# Altium schematic sheet CANOPi_Baseboard_RTC.SchDoc
size A4; DocumentNumber: 5; SheetNumber: 5; SheetTotal: 5; CopyrightYear: 2021
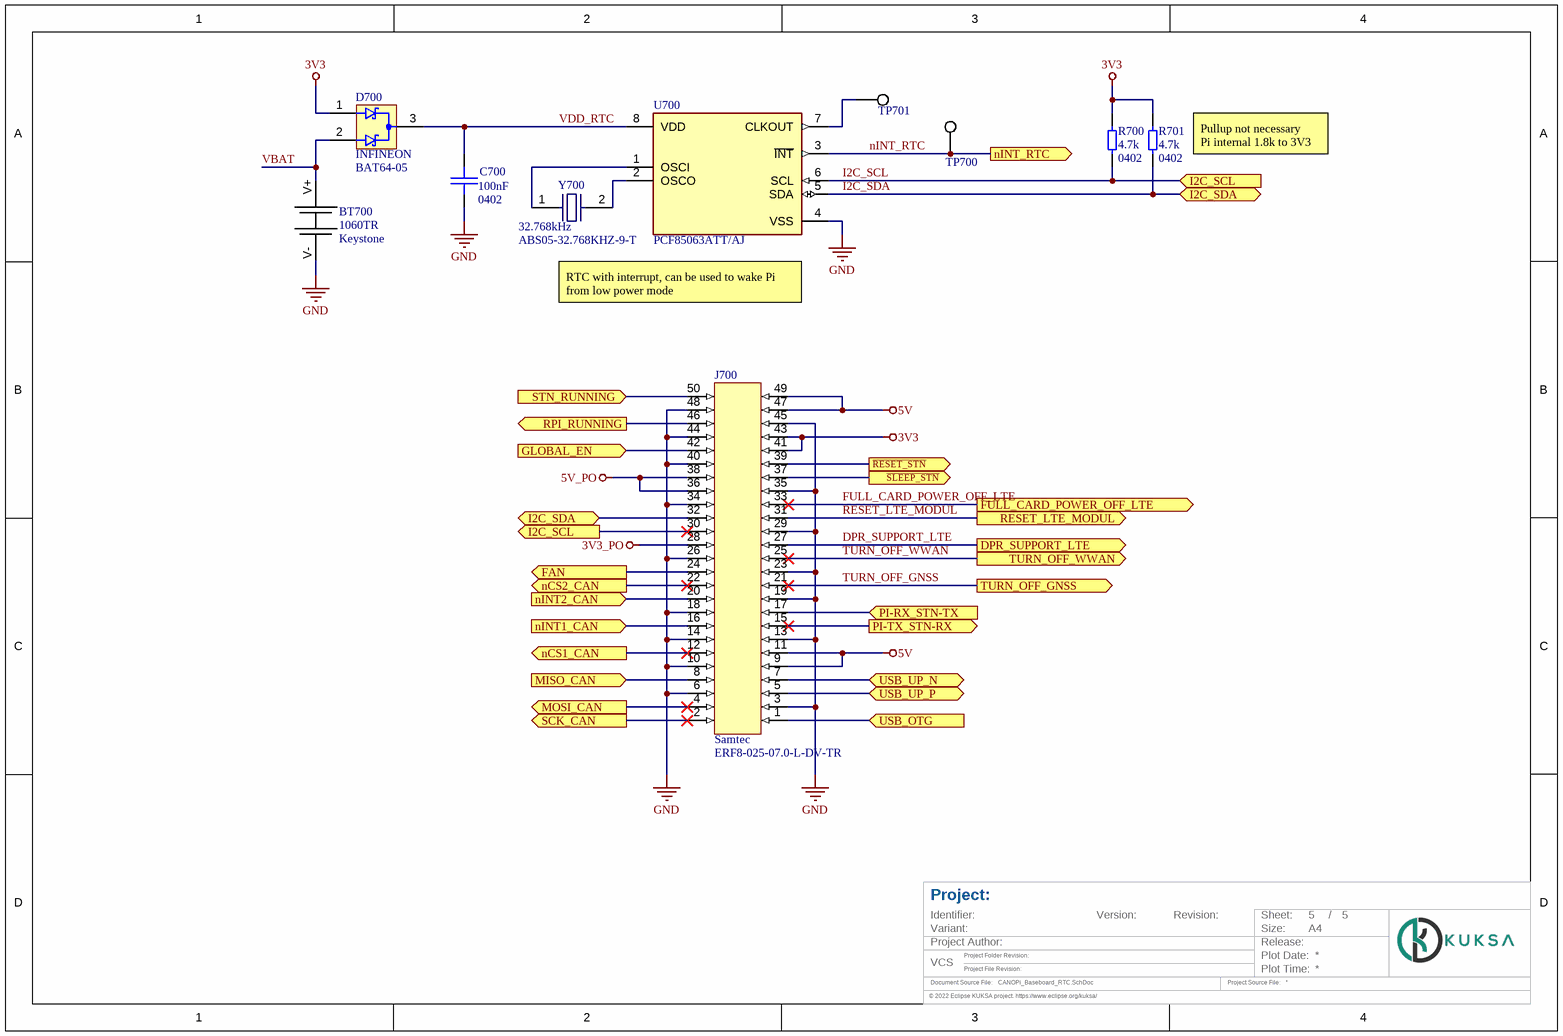
[diagram p0: CANOPi_Baseboard_RTC.SchDoc]

## Parts
BT700  Manufacturer Part Number: 1060TR  Manufacturer: Keystone  [KEYSTONE - 1060-Footprint-1]  (hidden comment: KEYSTONE - 1060)
C700  Capacitance: 100nF  Case: 0402  [CAP 0402 [1005 Metric] X050 N]  (hidden comment: CAP 0402 100n -10% +10% 6.3V X7R)
D700  Manufacturer: INFINEON  Manufacturer Part Number: BAT64-05  [INFINEON - BAT64-04]  (hidden comment: INFINEON - BAT64-05)
J700  Manufacturer: Samtec  Manufacturer Part Number: ERF8-025-07.0-L-DV-TR  [SAMTEC - ERF-025-05.0-L-DV-TR-Footprint-1]  (hidden comment: SAMTEC - ERF8-025-07.0-L-DV-TR)
R700  Resistance: 4.7k  Case: 0402  [RES 0402 [1005 Metric]_N]  (hidden comment: RES 0402 4K7 1% 0W0625)
R701  Resistance: 4.7k  Case: 0402  [RES 0402 [1005 Metric]_N]  (hidden comment: RES 0402 4K7 1% 0W0625)
TP700  Testpad, 0.8mm x 0.8mm, round  [Testpad, 0.8mm x 0.8mm, round]  (value not drawn)  (no BOM)
TP701  Testpad, 0.8mm x 0.8mm, round  [Testpad, 0.8mm x 0.8mm, round]  (value not drawn)  (no BOM)
U700  PCF85063ATT/AJ  [FP-SOT505-1-MFG]
Y700  Manufacturer Part Number: ABS05-32.768KHZ-9-T  Frequency: 32.768kHz  [ABRACON - ABS05-32.768KHZ-9-T]  (hidden comment: ABRACON - ABS05-32.768KHZ-9-T)

## Ports
DPR_SUPPORT_LTE (out), FAN (out), FULL_CARD_POWER_OFF_LTE (out), GLOBAL_EN (in), I2C_SCL (in), I2C_SCL (out), I2C_SDA (bidir), MISO_CAN (in), MOSI_CAN (out), nCS1_CAN (out), nCS2_CAN (out), nINT1_CAN (in), nINT2_CAN (in), nINT_RTC (out), PI-RX_STN-TX (in), PI-TX_STN-RX (out), RESET_LTE_MODUL (out), RPI_RUNNING (out), SCK_CAN (out), STN_RUNNING (in), TURN_OFF_GNSS (out), TURN_OFF_WWAN (out), USB_OTG (in), USB_UP_N (bidir), USB_UP_P (bidir), ~{RESET_STN} (out), ~{SLEEP_STN} (out)

## Nets
3V3: D700.1 J700.41 J700.43 R700.2 R701.2
3V3_PO: J700.28
5V: J700.9 J700.11 J700.47 J700.49
5V_PO: J700.36 J700.38
GND: BT700.V- C700.1 J700.3 J700.6 J700.10 J700.13 J700.14 J700.18 J700.19 J700.23 J700.26 J700.29 J700.34 J700.35 J700.40 J700.44 J700.45 J700.48 U700.4(VSS)
~{RESET_STN}: J700.39 ; port ~{RESET_STN}
~{SLEEP_STN}: J700.37 ; port ~{SLEEP_STN}
DPR_SUPPORT_LTE: J700.27 ; port DPR_SUPPORT_LTE
FAN: J700.24 ; port FAN
FULL_CARD_POWER_OFF_LTE: J700.33 ; port FULL_CARD_POWER_OFF_LTE
GLOBAL_EN: J700.42 ; port GLOBAL_EN
I2C_SCL: J700.30 R700.1 U700.6(SCL) ; port I2C_SCL
I2C_SDA: J700.32 R701.1 U700.5(SDA) ; port I2C_SDA
MISO_CAN: J700.8 ; port MISO_CAN
MOSI_CAN: J700.4 ; port MOSI_CAN
nCS1_CAN: J700.12 ; port nCS1_CAN
nCS2_CAN: J700.22 ; port nCS2_CAN
nINT1_CAN: J700.16 ; port nINT1_CAN
nINT2_CAN: J700.20 ; port nINT2_CAN
nINT_RTC: TP700.1 U700.3(~{INT}) ; port nINT_RTC
PI-RX_STN-TX: J700.17 ; port PI-RX_STN-TX
PI-TX_STN-RX: J700.15 ; port PI-TX_STN-RX
RESET_LTE_MODUL: J700.31 ; port RESET_LTE_MODUL
RPI_RUNNING: J700.46 ; port RPI_RUNNING
SCK_CAN: J700.2 ; port SCK_CAN
STN_RUNNING: J700.50 ; port STN_RUNNING
TURN_OFF_GNSS: J700.21 ; port TURN_OFF_GNSS
TURN_OFF_WWAN: J700.25 ; port TURN_OFF_WWAN
USB_OTG: J700.1 ; port USB_OTG
USB_UP_N: J700.7 ; port USB_UP_N
USB_UP_P: J700.5 ; port USB_UP_P
VBAT: BT700.V+ D700.2
VDD_RTC: C700.2 D700.3 U700.8(VDD)
NetTP701_1: TP701.1 U700.7(CLKOUT)
NetU700_1: U700.1(OSCI) Y700.1
NetU700_2: U700.2(OSCO) Y700.2

## Notes on the sheet
- (near R701) Pullup not necessary
  Pi internal 1.8k to 3V3
- RTC with interrupt, can be used to wake Pi from low power mode
- Project:
- Identifier:
- Version:
- Revision:
- Sheet:
- /
- VCS
- Variant:
- Document Source File:
- Project Author:
- Project Folder Revision:
- Project File Revision:
- Project Source File:
- Plot Date:
- Size:
- Plot Time:
- Release:
- A4
- © 2022 Eclipse KUKSA project. https://www.eclipse.org/kuksa/
- Drawn by:
- © Robert Bosch GmbH         . All rights reserved, also regarding any disposal, exploitation, reproduction, editing, distribution, as well as in the event of applications for industrial property rights.

## Library data of the parts
BT700 = CMP-11274-2: Batterie Halter (offen) Kreisförmige Scheibe, 20,0mm 1 Zellen SMD (SMT) Tab; Assembly: yes; Battery Sizes Accepted: CR2032; No. of Batteries: 1; Operating Temperature min: -50°C; ComponentLink1URL: https://www.keyelco.com/product.cfm/product_id/726; Case: Coin; ComponentLink1Description: Manufacturer Link; Operating Temperature max: 146°C; Mounting Type: SMT
C700 = CMP-04212-4: SMD/SMT 0402 6.3V -10% +10% X7R - Multilayer Ceramic Capacitors MLCC; Manufacturer: MURATA; Manufacturer Part Number: GRM155R70J104KA01#; Capacitance Tolerance pos: 10%; Value: 100nF; Assembly: yes; Operating Temperature min: -55°C; Voltage Rating: 6.3V; Operating Temperature max: 125°C; ComponentLink1URL: http://psearch.en.murata.com/capacitor/lineup/grm/; IPC Footprint Naming: CAPC1005X050; Capacitance Tolerance neg: -10%; ComponentLink1Description: Datasheet; Dielectric Type: X7R; Mounting Type: SMT
D700 = CMP-07595-3: Dual Silicon Schottky Diodes; Assembly: yes; Forward Current: 250mA; Forward Voltage: 750mV; Reverse Voltage: 40V; Case: SOT-23; ComponentLink1Description: Datasheet; ComponentLink1URL: https://www.infineon.com/dgdl/Infineon-BAT64SERIES-DataSheet-v01_00-EN.pdf?fileId=5546d4626d66c2b1016d73f85ab420ed; Mounting Type: SMT; Operating Temperature max: 150°C; Operating Temperature min: -55°C
J700 = CMP-11271-4: 50 Poliger Steckverbinder Sockel, äußere Abdeckungskontakte Oberflächenmontage Gold; Current Rating: 1,1A; Voltage Rating: 200V; Gender: Female; Pitch Spacing: 800µm; Assembly: yes; System: Connector; ComponentLink1URL: https://www.samtec.com/de/products/erf8-025-07.0-l-dv-k-tr; ComponentLink1Description: Manufacturer Link; Operating Temperature max: 150°C; Operating Temperature min: -40°C; Number of Rows: 2; Mounting Type: SMT; Number of Pins: 50
R700 R701 = CMP-00920-7: RC0402 series chip resistor with lead-free terminations made by thick film process; Manufacturer Part Number: RC0402FR-074K7L; Manufacturer: YAGEO; Value: 4.7k; Power Rating: 62.5mW; Assembly: yes; Voltage Rating: 50V; Current Rating: 1A; Temperature Coefficient: ±100ppm/K; ComponentLink1URL: https://www.yageo.com/upload/media/product/productsearch/datasheet/rchip/PYu-RC_Group_51_RoHS_L_10.pdf; Operating Temperature max: 155°C; IPC Footprint Naming: RESC1005X04; Resistor Element Type: Thick Film; Mounting Type: SMT; Operating Temperature min: -55°C; ComponentLink1Description: Datasheet; Resistance Tolerance: 1%
TP700 TP701 = CMP-00390-13: Assembly: no; Case: 0.8x0.8mm, round
U700 = CMP-10083-000008-1: IC RTC CLK/CALENDAR I2C 8TSSOP; Manufacturer: NXP Semiconductors; Min Supply Voltage: 0.9V; Max Supply Voltage: 5.5V; Nominal Supply Current: 0.22-18uA; Number Of Outputs: 1; Standoff Height: 0.05mm; Frequency: 32.768kHz; Temperature Range Low: -40°C; Height: 1.1mm; Digikey Description: IC RTC CLK/CALENDAR I2C 8TSSOP; Device Class L2: Clock and Timing; Ambient Temperature Range High: +85°C; ComponentLink2URL: https://www.nxp.com/docs/en/data-sheet/PCF85063A.pdf; Category: IC; Temperature: -40°C to +85°C; RoHS: TRUE; Ambient Temperature Range Low: -40°C; Footprint Url: https://www.nxp.com/docs/en/package-information/SOT505-1.pdf; Octopart: https://octopart.com/pcf85063att%2Faj-nxp+semiconductors-46729225; Temperature Range High: +85°C; Device Class L3: Real Time Clocks; Automotive: No; Package: SOT505-1; Manufacturer Part Number: PCF85063ATT/AJ; Device Class L1: Integrated Circuits (ICs); Interface: I2C; Lead Free: Yes; ComponentLink2Description: Datasheet; Mouser Description: Real Time Clock Serial Clock/Calendar/Alarm/Timer/Interrupt 8-Pin TSSOP T/R
Y700 = CMP-00465-3: Crystals 32.768KHz 9.0pF 20ppm -40C +85C; Load Capacitance (CL): 12.5pF; Assembly: yes; Frequency Stability: 0; Manufacturer: ABRACON; Frequency Tolerance: 20ppm; Operating Temperature max: 85°C; Mounting Type: SMT; Operating Temperature min: -40°C; Case: 2-SMD (1.60mm x 1.00mm); ComponentLink1Description: Datasheet; ComponentLink1URL: http://www.mouser.com/ds/2/3/ABS05-25797.pdf